# Altium schematic sheet display.SchDoc
size A4; SheetNumber: 5; SheetTotal: 6
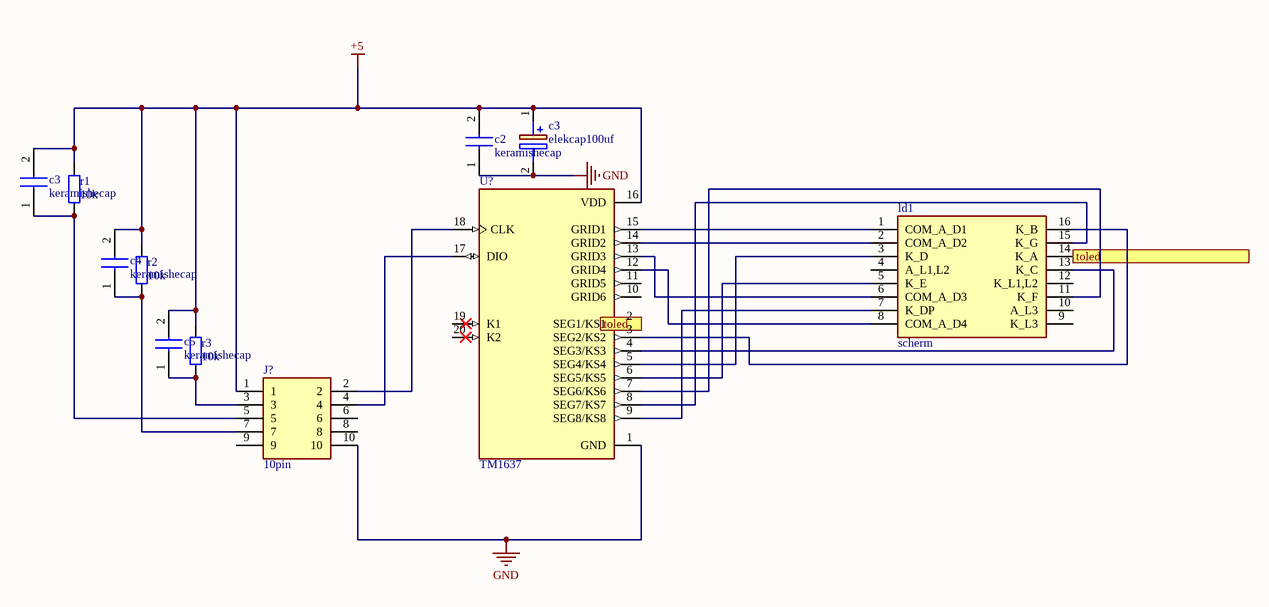
[diagram p0: display.SchDoc]

## Parts
(Parts that share a designator on the sheet are numbered #1, #2 ... from top to bottom, then left to right.)
c2  keramishecap  [0805]
c3#1  elekcap100uf  [elekcap100uf]
c3#2  keramishecap  [0805]
c4  keramishecap  [0805]
c5  keramishecap  [0805]
J?  10pin  [10pin]
ld1  scherm  [sherm]
r1  10k  [0805]
r2  10k  [0805]
r3  10k  [0805]
U?  TM1637  [ledic]

## Ports
toled

## Nets
+5: c2.2 c3#1.1(+) c3#2.2 c4.2 c5.2 J?.1 r1.2 r2.2 r3.2 U?.16(VDD)
GND: c2.1 c3#1.2(-) J?.10 U?.1(GND)
toled: ld1.14(K_A) U?.2(SEG1/KS1) ; port toled
Netc3#2_1: c3#2.1 J?.5 r1.1
Netc4_1: c4.1 J?.7 r2.1
Netc5_1: c5.1 J?.3 r3.1
NetJ?_2: J?.2 U?.18(CLK)
NetJ?_4: J?.4 U?.17(DIO)
Netld1_1: ld1.1(COM_A_D1) U?.15(GRID1)
Netld1_2: ld1.2(COM_A_D2) U?.14(GRID2)
Netld1_3: ld1.3(K_D) U?.5(SEG4/KS4)
Netld1_5: ld1.5(K_E) U?.6(SEG5/KS5)
Netld1_6: ld1.6(COM_A_D3) U?.13(GRID3)
Netld1_7: ld1.7(K_DP) U?.9(SEG8/KS8)
Netld1_8: ld1.8(COM_A_D4) U?.12(GRID4)
Netld1_11: ld1.11(K_F) U?.7(SEG6/KS6)
Netld1_13: ld1.13(K_C) U?.4(SEG3/KS3)
Netld1_15: ld1.15(K_G) U?.8(SEG7/KS7)
Netld1_16: ld1.16(K_B) U?.3(SEG2/KS2)

Not connected (* = marked no-connect by the designer): J? 6 8 9; ld1 4(A_L1,L2) 9(K_L3) 10(A_L3) 12(K_L1,L2); U? 10(GRID6) 11(GRID5) 19(K1) 20(K2)

## Library data of the parts
c2 c3#2 c4 c5 = keramishecap: Capacitor; Manufacturer_Name: Kemet; Manufacturer_Part_Number: C1206C104K3GACAUTO; Datasheet Link: https://www.kemet.com/specsheet/C1206C104K3GACAUTO; Height: 1.8mm
c3#1 = elekcap100uf: Capacitor Polarised; Manufacturer_Name: Kemet; Manufacturer_Part_Number: ESH107M050AG3KA; Datasheet Link: https://connect.kemet.com:7667/gateway/IntelliData-ComponentDocumentation/1.0/download/specsheet/ESH107M050AG3KA; Height: 12.5mm
J? = 10pin: Connector; Manufacturer_Name: TE Connectivity; Manufacturer_Part_Number: 5103309-1; Datasheet Link: https://www.te.com/commerce/DocumentDelivery/DDEController?Action=showdoc&DocId=Customer+Drawing%7F5103309%7FE1%7Fpdf%7FEnglish%7FENG_CD_5103309_E1.pdf%7F5103309-1; Height: 9.855mm
ld1 = scherm: Display; Manufacturer_Name: Vishay; Manufacturer_Part_Number: TDCG1050M; Datasheet Link: https://componentsearchengine.com//TDCG1050M.pdf; Height: 7.25mm; Mouser2 Part Number: 78-TDCG1050; Mouser2 Price/Stock: https://www.mouser.com/Search/Refine.aspx?Keyword=78-TDCG1050
r1-r3 = weerstand0805: WRIS-PSMB SMT Metal Plate Resistor, size 0805, 5mOhm, 0.5W; Manufacturer: Wurth Elektronik; Manufacturer Part Number: 580060720003; Rated Current: 10A; Temperature Coefficient of Resistance: +/-100ppm/degC; Technical Reference: MB0805R005F102KAATP0000; Resistance Tolerance: +/-1%; ComponentLink1Description: Manufacturer; ComponentLink1URL: http://www.we-online.de; ComponentLink2Description: Datasheet; ComponentLink2URL: https://www.we-online.com/catalog/datasheet/580060720003.pdf; Rated Power: 0.5W; Resistance: 5mOhm; Mounting Technology: SMT; Height: 0.35mm; Packaging: Tape and Reel; Published Date: May 2020; Size: 0805; Length: 2mm; Operating Temperature: -55 to +155degC; Width: 1.25mm
U? = TM1637: LED Drive Control Special Circuit; MF: Titan Micro Electronics; Package: Package; Availability: Not in stock; SnapEDA_Link: https://www.snapeda.com/parts/TM1637/Titan+Micro+Electronics/view-part/?ref=snap; MP: TM1637; Check_prices: https://www.snapeda.com/parts/TM1637/Titan+Micro+Electronics/view-part/?ref=eda; Value: *; Price: None